# EAGLE schematic GPS_radiologger_v16 (EAGLE 9.6.2)
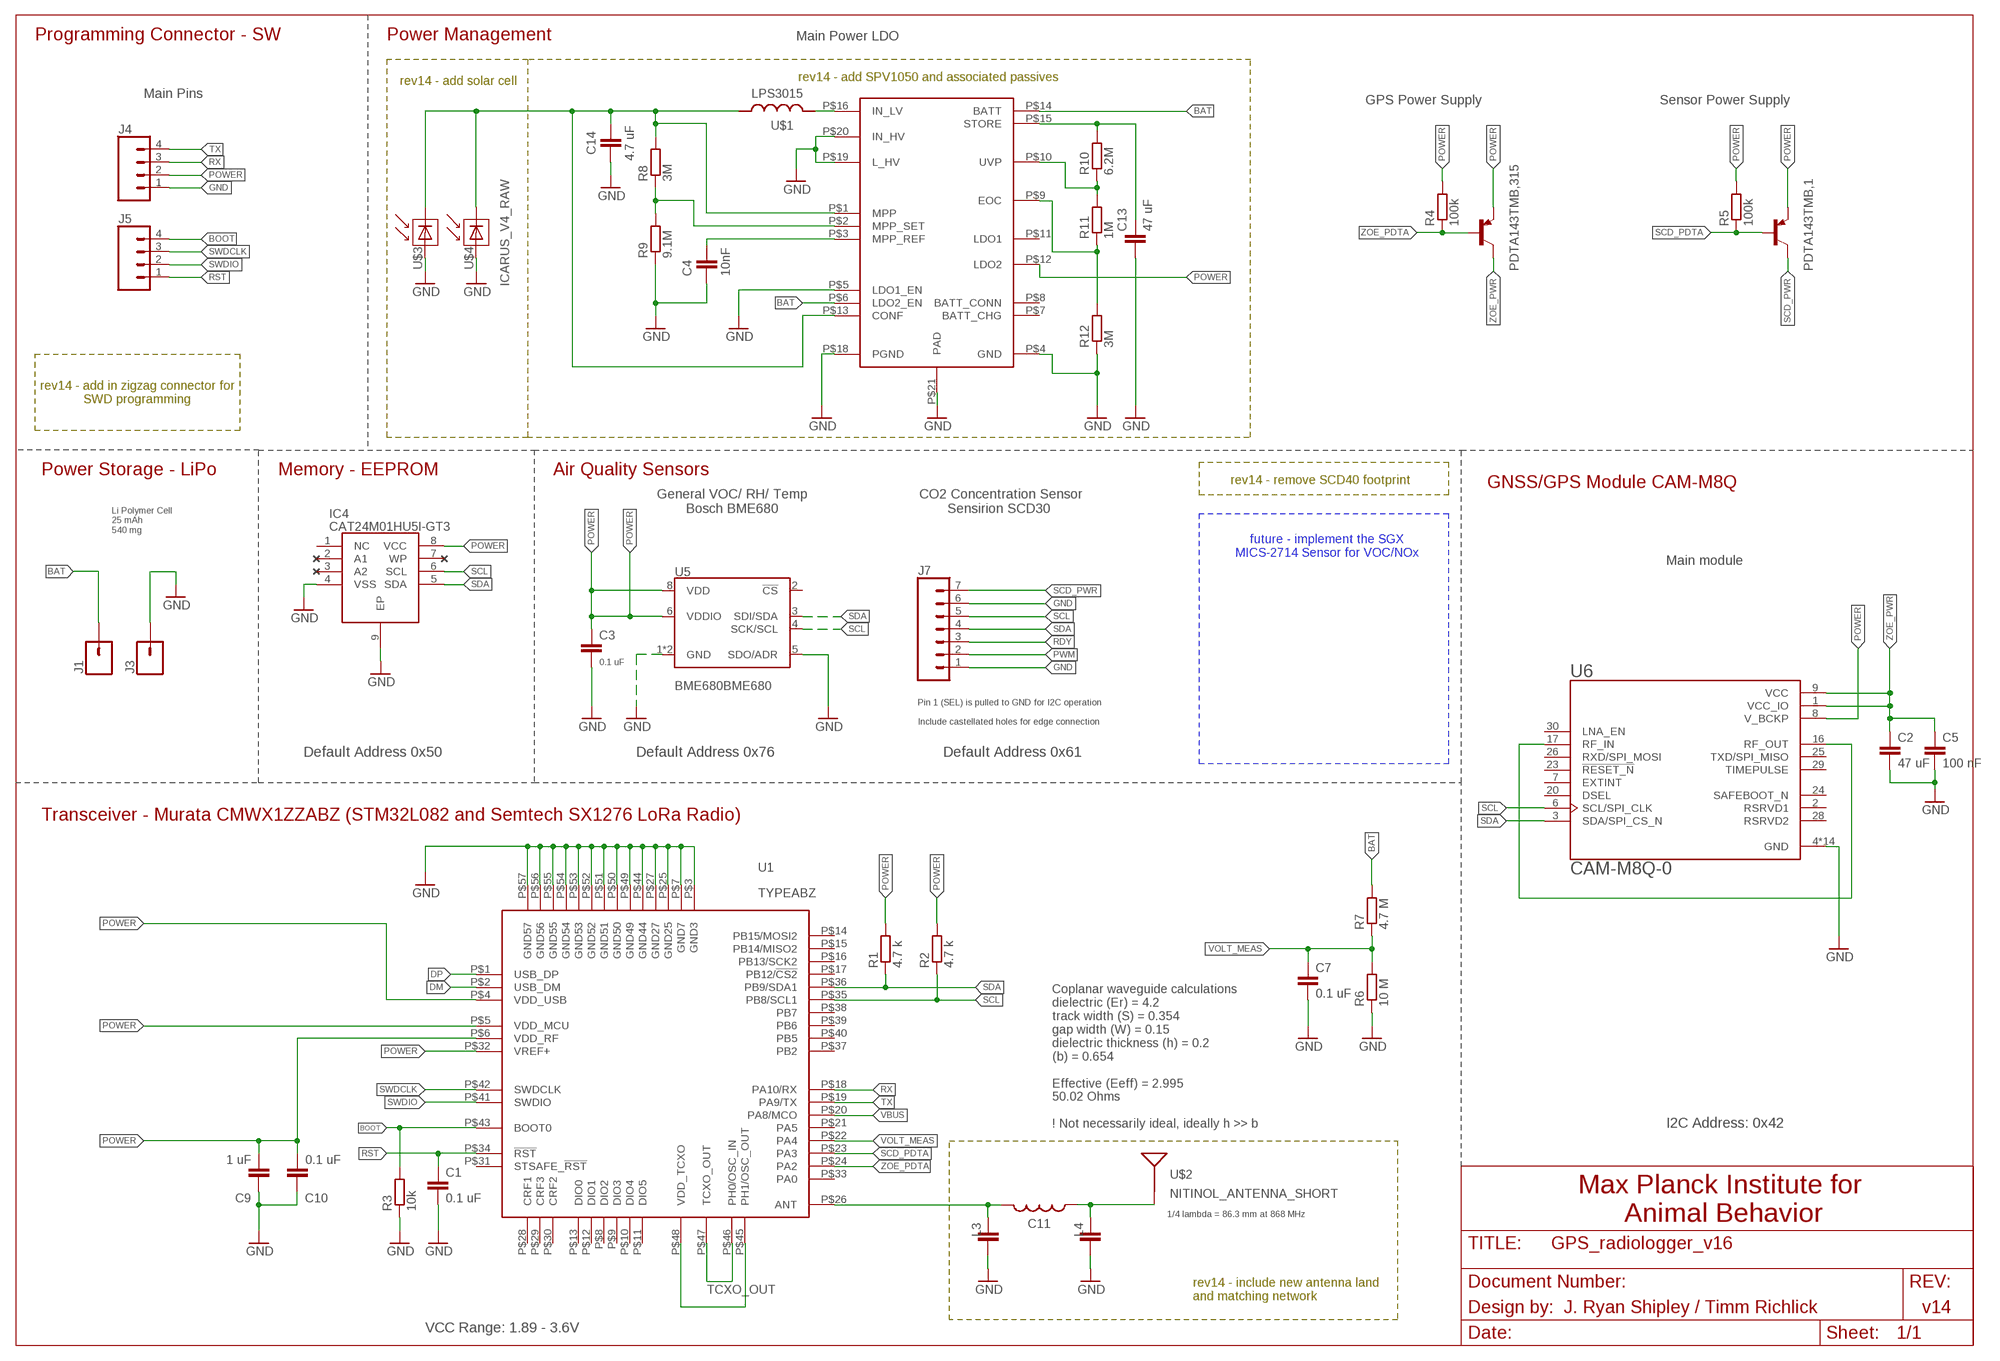
[diagram p0: schematic, sheet 1]

## Parts
C1  0.1 uF  C-EUC0201  [C0201]
C2  47 uF  C-EUC0201  [C0201]
C3  0.1 uF  C-EUC0201  [C0201]
C4  10nF  C-EUC0201  [C0201]
C5  100 nF  C-EUC0201  [C0201]
C7  0.1 uF  C-EUC0201  [C0201]
C9  1 uF  C-EUC0201  [C0201]
C10  0.1 uF  C-EUC0201  [C0201]
C11  0.1uF  L-USL0201  [L0201]
C13  47 uF  C-EUC0805K  [C0805K]
C14  4.7 uF  C-EUC0201  [C0201]
IC4  CAT24M01HU5I-GT3  [SON50P300X200X55-9N]
J1  CONN_01PTH_NO_SILK_YES_STOP  [1X01_NO_SILK]
J3  CONN_01PTH_NO_SILK_YES_STOP  [1X01_NO_SILK]
J4  CONN_041.27MM_NO_SILK  [1X04_1.27MM_NO_SILK]
J5  CONN_041.27MM_NO_SILK  [1X04_1.27MM_NO_SILK]
J7  CONN_07NO_SILK  [1X07_NO_SILK]
L3  C-EUC0201  [C0201]
L4  C-EUC0201  [C0201]
PDTA143TMB,1  TINYPICO-PNPAMB  [SOT883(B)]
PDTA143TMB,315  TINYPICO-PNPAMB  [SOT883(B)]
R1  4.7 k  R-EU_R0201  [R0201]
R2  4.7 k  R-EU_R0201  [R0201]
R3  10k  R-EU_R0201  [R0201]
R4  100k  R-EU_R0201  [R0201]
R5  100k  R-EU_R0201  [R0201]
R6  10 M  R-EU_R0201  [R0201]
R7  4.7 M  R-EU_R0201  [R0201]
R8  3M  R-EU_R0201  [R0201]
R9  9.1M  R-EU_R0201  [R0201]
R10  6.2M  R-EU_R0201  [R0201]
R11  1M  R-EU_R0201  [R0201]
R12  3M  R-EU_R0201  [R0201]
U1  TYPEABZ  [TYPEABZ]
U4  SPV1050  [SPV1050]
U5  BME680BME680  [LGA3.0X3.0]
U6  CAM-M8Q-0  [LCC100P960X1400X210-31N]
U$1  LPS3015  [LPS_3015]
U$2  NITINOL_ANTENNA_SHORT  [ICARUS_NITINOL_ANTENNA_SHORT]
U$3  ICARUS_V4_RAW  [ICARUS_FULL_TOP]
U$4  ICARUS_V4_RAW  [ICARUS_FULL_TOP]

## Nets
BAT: J1.1 R7.2 U4.P$6(LDO2_EN) U4.P$14(BATT)
BOOT: J5.4 R3.2 U1.P$43(BOOT0)
DM: U1.P$2(USB_DM)
DP: U1.P$1(USB_DP)
GND: C1.2 C2.2 C3.2 C4.2 C5.2 C7.2 C9.1 C10.1 C13.2 C14.2 IC4.4(VSS) IC4.9(EP) J3.1 J4.1 J7.1 J7.6 L3.2 L4.2 R3.1 R6.1 R9.1 R12.1 U1.P$3(GND3) U1.P$7(GND7) U1.P$25(GND25) U1.P$27(GND27) U1.P$44(GND44) U1.P$49(GND49) U1.P$50(GND50) U1.P$51(GND51) U1.P$52(GND52) U1.P$53(GND53) U1.P$54(GND54) U1.P$55(GND55) U1.P$56(GND56) U1.P$57(GND57) U4.P$4(GND) U4.P$5(LDO1_EN) U4.P$18(PGND) U4.P$19(L_HV) U4.P$20(IN_HV) U4.P$21(PAD) U5.1(GND) U5.5(SDO/ADR) U5.7(GND) U6.4(GND) U6.5(GND) U6.10(GND) U6.11(GND) U6.12(GND) U6.13(GND) U6.14(GND) U6.15(GND) U6.18(GND) U6.19(GND) U6.21(GND) U6.22(GND) U6.27(GND) U6.31(GND) U$3.P$2(MINUS) U$4.P$2(MINUS)
N$1: U1.P$45(PH1/OSC_OUT) U1.P$48(VDD_TCXO)
N$2 [antenna]: C11.2 L3.1 U1.P$26(ANT)
N$4: U4.P$16(IN_LV) U$1.P$2
N$6: R8.1 R9.2 U4.P$2(MPP_SET)
N$7: C14.1 R8.2 U4.P$1(MPP) U4.P$13(CONF) U$1.P$1 U$3.P$1(PLUS) U$4.P$1(PLUS)
N$8: R10.1 R11.2 U4.P$10(UVP)
N$9: R11.1 R12.2 U4.P$9(EOC)
N$11 [antenna]: C11.1 L4.1 U$2.1(SIGNAL) U$2.2(SIGNAL) U$2.3(SIGNAL)
N$12: C13.1 R10.2 U4.P$15(STORE)
N$13: C4.1 U4.P$3(MPP_REF)
N$16: U6.16(RF_OUT) U6.17(RF_IN)
POWER [power]: C3.1 C9.2 C10.2 IC4.8(VCC) J4.2 PDTA143TMB,1.2(E) PDTA143TMB,315.2(E) R1.2 R2.2 R4.2 R5.2 U1.P$4(VDD_USB) U1.P$5(VDD_MCU) U1.P$6(VDD_RF) U1.P$32(VREF+) U4.P$12(LDO2) U5.6(VDDIO) U5.8(VDD) U6.8(V_BCKP)
PWM: J7.2
RDY: J7.3
RST: C1.1 J5.1 U1.P$34(!RST)
RX: J4.3 U1.P$18(PA10/RX)
SCD_PDTA: PDTA143TMB,1.1(B) R5.1 U1.P$23(PA3)
SCD_PWR: J7.7 PDTA143TMB,1.3(C)
SCL: IC4.6(SCL) J7.5 R2.1 U1.P$35(PB8/SCL1) U5.4(SCK/SCL) U6.6(SCL/SPI_CLK)
SDA: IC4.5(SDA) J7.4 R1.1 U1.P$36(PB9/SDA1) U5.3(SDI/SDA) U6.3(SDA/SPI_CS_N)
SWDCLK: J5.3 U1.P$42(SWDCLK)
SWDIO: J5.2 U1.P$41(SWDIO)
TCXO_OUT: U1.P$46(PH0/OSC_IN) U1.P$47(TCXO_OUT)
TX: J4.4 U1.P$19(PA9/TX)
VBUS: U1.P$20(PA8/MCO)
VOLT_MEAS: C7.1 R6.2 R7.1 U1.P$22(PA4)
ZOE_PDTA: PDTA143TMB,315.1(B) R4.1 U1.P$24(PA2)
ZOE_PWR: C2.1 C5.1 PDTA143TMB,315.3(C) U6.1(VCC_IO) U6.9(VCC)
Unconnected: IC4.1(NC) IC4.2(A1) IC4.3(A2) IC4.7(WP) U1.P$8(DIO2) U1.P$9(DIO3) U1.P$10(DIO4) U1.P$11(DIO5) U1.P$12(DIO1) U1.P$13(DIO0) U1.P$14(PB15/MOSI2) U1.P$15(PB14/MISO2) U1.P$16(PB13/SCK2) U1.P$17(PB12/!CS2) U1.P$21(PA5) U1.P$28(CRF1) U1.P$29(CRF3) U1.P$30(CRF2) U1.P$31(STSAFE_!RST) U1.P$33(PA0) U1.P$37(PB2) U1.P$38(PB7) U1.P$39(PB6) U1.P$40(PB5) U4.P$7(BATT_CHG) U4.P$8(BATT_CONN) U4.P$11(LDO1) U5.2(!CS) U6.2(RSRVD1) U6.7(EXTINT) U6.20(DSEL) U6.23(!RESET_N) U6.24(SAFEBOOT_N) U6.25(TXD/SPI_MISO) U6.26(RXD/SPI_MOSI) U6.28(RSRVD2) U6.29(TIMEPULSE) U6.30(LNA_EN)

## Notes on the sheet
- Programming Connector - SW | Power Management | Main Power LDO
- rev14 - add SPV1050 and associated passives
- rev14 - add solar cell
- Main Pins
- GPS Power Supply | Sensor Power Supply
- rev14 - add in zigzag connector for
  SWD programming
- Power Storage - LiPo | Memory - EEPROM | Air Quality Sensors | rev14 - remove SCD40 footprint
- GNSS/GPS Module CAM-M8Q
- General VOC/ RH/ Temp
  Bosch BME680
- CO2 Concentration Sensor
  Sensirion SCD30
- Li Polymer Cell
  25 mAh
  540 mg
- future - implement the SGX
  MICS-2714 Sensor for VOC/NOx
- Main module
- Pin 1 (SEL) is pulled to GND for I2C operation
- Include castellated holes for edge connection
- Default Address 0x50 | Default Address 0x76 | Default Address 0x61
- Transceiver - Murata CMWX1ZZABZ (STM32L082 and Semtech SX1276 LoRa Radio)
- Coplanar waveguide calculations
  dielectric (Er) = 4.2
  track width (S) = 0.354
  gap width (W) = 0.15
  dielectric thickness (h) = 0.2
  (b) = 0.654
  
  Effective (Eeff) = 2.995
  50.02 Ohms
  
  ! Not necessarily ideal, ideally h >> b
- I2C Address: 0x42
- Max Planck Institute for 
  Animal Behavior
- 1/4 lambda = 86.3 mm at 868 MHz
- rev14 - include new antenna land
  and matching network
- Design by: | J. Ryan Shipley / Timm Richlick | v14
- VCC Range: 1.89 - 3.6V

## Library data of the parts
C1-C5 C7 C9 C10 C13 C14 L3 L4 = rcl:C-EU: CAPACITOR, European symbol; SPICEPREFIX: C
C11 = rcl:L-US: INDUCTOR, American symbol; SPICEPREFIX: L
IC4 = CAT24M01HU5I-GT3-CorrectedV2:CAT24M01HU5I-GT3: EEPROM 1MB I2C SERIAL EEPROM Source: Datasheet <http://www.onsemi.com/pub/Collateral/CAT24M01-D.PDF>; ALLIED_NUMBER: 70300250; ALLIED_PRICE-STOCK: http://www.alliedelec.com/on-semiconductor-cat24m01hu5i-gt3/70300250/; DESCRIPTION: EEPROM 1MB I2C SERIAL EEPROM; HEIGHT: 0.55mm; MANUFACTURER_NAME: ON Semiconductor; MANUFACTURER_PART_NUMBER: CAT24M01HU5I-GT3; MOUSER_PART_NUMBER: 863-CAT24M01HU5I-GT3; MOUSER_PRICE-STOCK: https://www.mouser.com/Search/Refine.aspx?Keyword=863-CAT24M01HU5I-GT3; RS_PART_NUMBER: 7814831P; RS_PRICE-STOCK: http://uk.rs-online.com/web/p/products/7814831P
J1 J3 = SparkFun-Connectors:CONN_01: Single connection point. Often used as Generic Header-pin footprint for 0.1 inch spaced/style header connections On any of the 0.1 inch spaced packages, you can populate with these: Break Away Headers - Straight <https://www.sparkfun.com/products/116> (PRT-00116) Break Away Male Headers - Right Angle <https://www.sparkfun.com/products/553> (PRT-00553) Female Headers <https://www.sparkfun.com/products/115> (PRT-00115) Break Away Headers - Machine Pin <https://www.sparkfun.com/products/117> (PRT-00117) Break Away Female Headers - Swiss Machine Pin <https://www.sparkfun.com/products/743> (PRT-00743) This device is also useful as a general connection point to wire up your design to another part of your project. Our various solder wires solder well into these plated through hole pads. Hook-Up Wire - Assortment (Stranded, 22 AWG) <https://www.sparkfun.com/products/11375> (PRT-11375) Hook-Up Wire - Assortment (Solid Core, 22 AWG) <https://www.sparkfun.com/products/11367> (PRT-11367) View the entire wire category on our website here <https://www.sparkfun.com/categories/141> Special notes: SMTSO-256-ET is a "flush mount" nut for a 4-40 screw. We mostly use this on specialty testbeds; it is a nice way to connect hardware to your PCB at an adjustable hieght. Also note, the SNAP packages are for using a snappable style connector. We sell a baggie of snaps and they are also used on two LilyPad designs: Snap Assortment - 30 pack (male and female) <https://www.sparkfun.com/products/11347> (DEV-11347) LilyPad Arduino SimpleSnap <https://www.sparkfun.com/products/10941> (DEV-10941) LilyPad SimpleSnap Protoboard <https://www.sparkfun.com/products/10940> (DEV-10940)
J4 J5 = SparkFun-Connectors:CONN_04: Multi connection point. Often used as Generic Header-pin footprint for 0.1 inch spaced/style header connections On any of the 0.1 inch spaced packages, you can populate with these: Break Away Headers - Straight <https://www.sparkfun.com/products/116> (PRT-00116) Break Away Male Headers - Right Angle <https://www.sparkfun.com/products/553> (PRT-00553) Female Headers <https://www.sparkfun.com/products/115> (PRT-00115) Break Away Headers - Machine Pin <https://www.sparkfun.com/products/117> (PRT-00117) Break Away Female Headers - Swiss Machine Pin <https://www.sparkfun.com/products/743> (PRT-00743) For SCREWTERMINALS and SPRING TERMINALS visit here: Screw Terimnals on SparkFun.com <https://www.sparkfun.com/search/results?term=Screw+Terminals> (5mm/3.5mm/2.54mm spacing) This device is also useful as a general connection point to wire up your design to another part of your project. Our various solder wires solder well into these plated through hole pads. Hook-Up Wire - Assortment (Stranded, 22 AWG) <https://www.sparkfun.com/products/11375> (PRT-11375) Hook-Up Wire - Assortment (Solid Core, 22 AWG) <https://www.sparkfun.com/products/11367> (PRT-11367) View the entire wire category on our website here <https://www.sparkfun.com/categories/141> Special notes: Molex polarized connector foot print use with SKU : PRT-08231 with associated crimp pins and housings. 1MM SMD Version SKU: PRT-10208
J7 = SparkFun-Connectors:CONN_07: Multi connection point. Often used as Generic Header-pin footprint for 0.1 inch spaced/style header connections On any of the 0.1 inch spaced packages, you can populate with these: Break Away Headers - Straight <https://www.sparkfun.com/products/116> (PRT-00116) Break Away Male Headers - Right Angle <https://www.sparkfun.com/products/553> (PRT-00553) Female Headers <https://www.sparkfun.com/products/115> (PRT-00115) Break Away Headers - Machine Pin <https://www.sparkfun.com/products/117> (PRT-00117) Break Away Female Headers - Swiss Machine Pin <https://www.sparkfun.com/products/743> (PRT-00743) For SCREWTERMINALS and SPRING TERMINALS visit here: Screw Terimnals on SparkFun.com <https://www.sparkfun.com/search/results?term=Screw+Terminals> (5mm/3.5mm/2.54mm spacing) This device is also useful as a general connection point to wire up your design to another part of your project. Our various solder wires solder well into these plated through hole pads. Hook-Up Wire - Assortment (Stranded, 22 AWG) <https://www.sparkfun.com/products/11375> (PRT-11375) Hook-Up Wire - Assortment (Solid Core, 22 AWG) <https://www.sparkfun.com/products/11367> (PRT-11367) View the entire wire category on our website here <https://www.sparkfun.com/categories/141> Special notes: Molex polarized connector foot print use with SKU : PRT-08231 with associated crimp pins and housings. 1MM SMD Version SKU: PRT-10208 NOTES ON THE VARIANTS LOCK and LOCK_LONGPADS... This footprint was designed to help hold the alignment of a through-hole component (i.e. 6-pin header) while soldering it into place. You may notice that each hole has been shifted either up or down by 0.005 of an inch from it's more standard position (which is a perfectly straight line). This slight alteration caused the pins (the squares in the middle) to touch the edges of the holes. Because they are alternating, it causes a "brace" to hold the component in place. 0.005 has proven to be the perfect amount of "off-center" position when using our standard breakaway headers. Although looks a little odd when you look at the bare footprint, once you have a header in there, the alteration is very hard to notice. Also,if you push a header all the way into place, it is covered up entirely on the bottom side.
PDTA143TMB,1 PDTA143TMB,315 = UnexpectedMaker:TINYPICO-PNP: PNP general purpose transistors AAL Eindhoven MK
R1-R12 = rcl:R-EU_: RESISTOR, European symbol; SPICEPREFIX: R
U1 = Kris:TYPEABZ: CMWX1ZZABZ-078
U4 = STM-SPV1050_V2:SPV1050
U5 = SparkFun-Sensors:BME680: Bosch BME680 – Combined Humidity and Pressure Sensor The BME680 is as combined digital humidity, pressure and temperature sensor based on proven sensing principles. The sensor module is housed in an extremely compact metal-lid LGA package with a footprint of only 3.0×3.0mm with a height of 0.93mm. Its small dimensions and its low power consumption allow the implementation in battery driven devices such as handsets, GPS modules or watches.; PROD_ID: IC-14656
U6 = CAM-M8Q-0:CAM-M8Q-0: u-blox M8 GNSS Antenna Module*Flash*TCXO; AVAILABILITY: Unavailable; DESCRIPTION: CAM-M8 RF Receiver BeiDou, GLONASS, GNSS, GPS 1.575GHz -167dBm On-Board, Chip Module; MF: U-Blox America; MP: CAM-M8Q-0; PACKAGE: SMD-31 u-blox; PRICE: None
U$1 = coilcraft_custom:LPS3015
U$2 = Antenna_mounts:NITINOL_ANTENNA_SHORT
U$3 U$4 = TrisolX_Solar_Cells:ICARUS_V4_RAW

## Net classes
1 power: width 0.305 mm
2 antenna: width 0.356 mm, clearance 0.178 mm